# EAGLE design main (EAGLE 6.5.0)
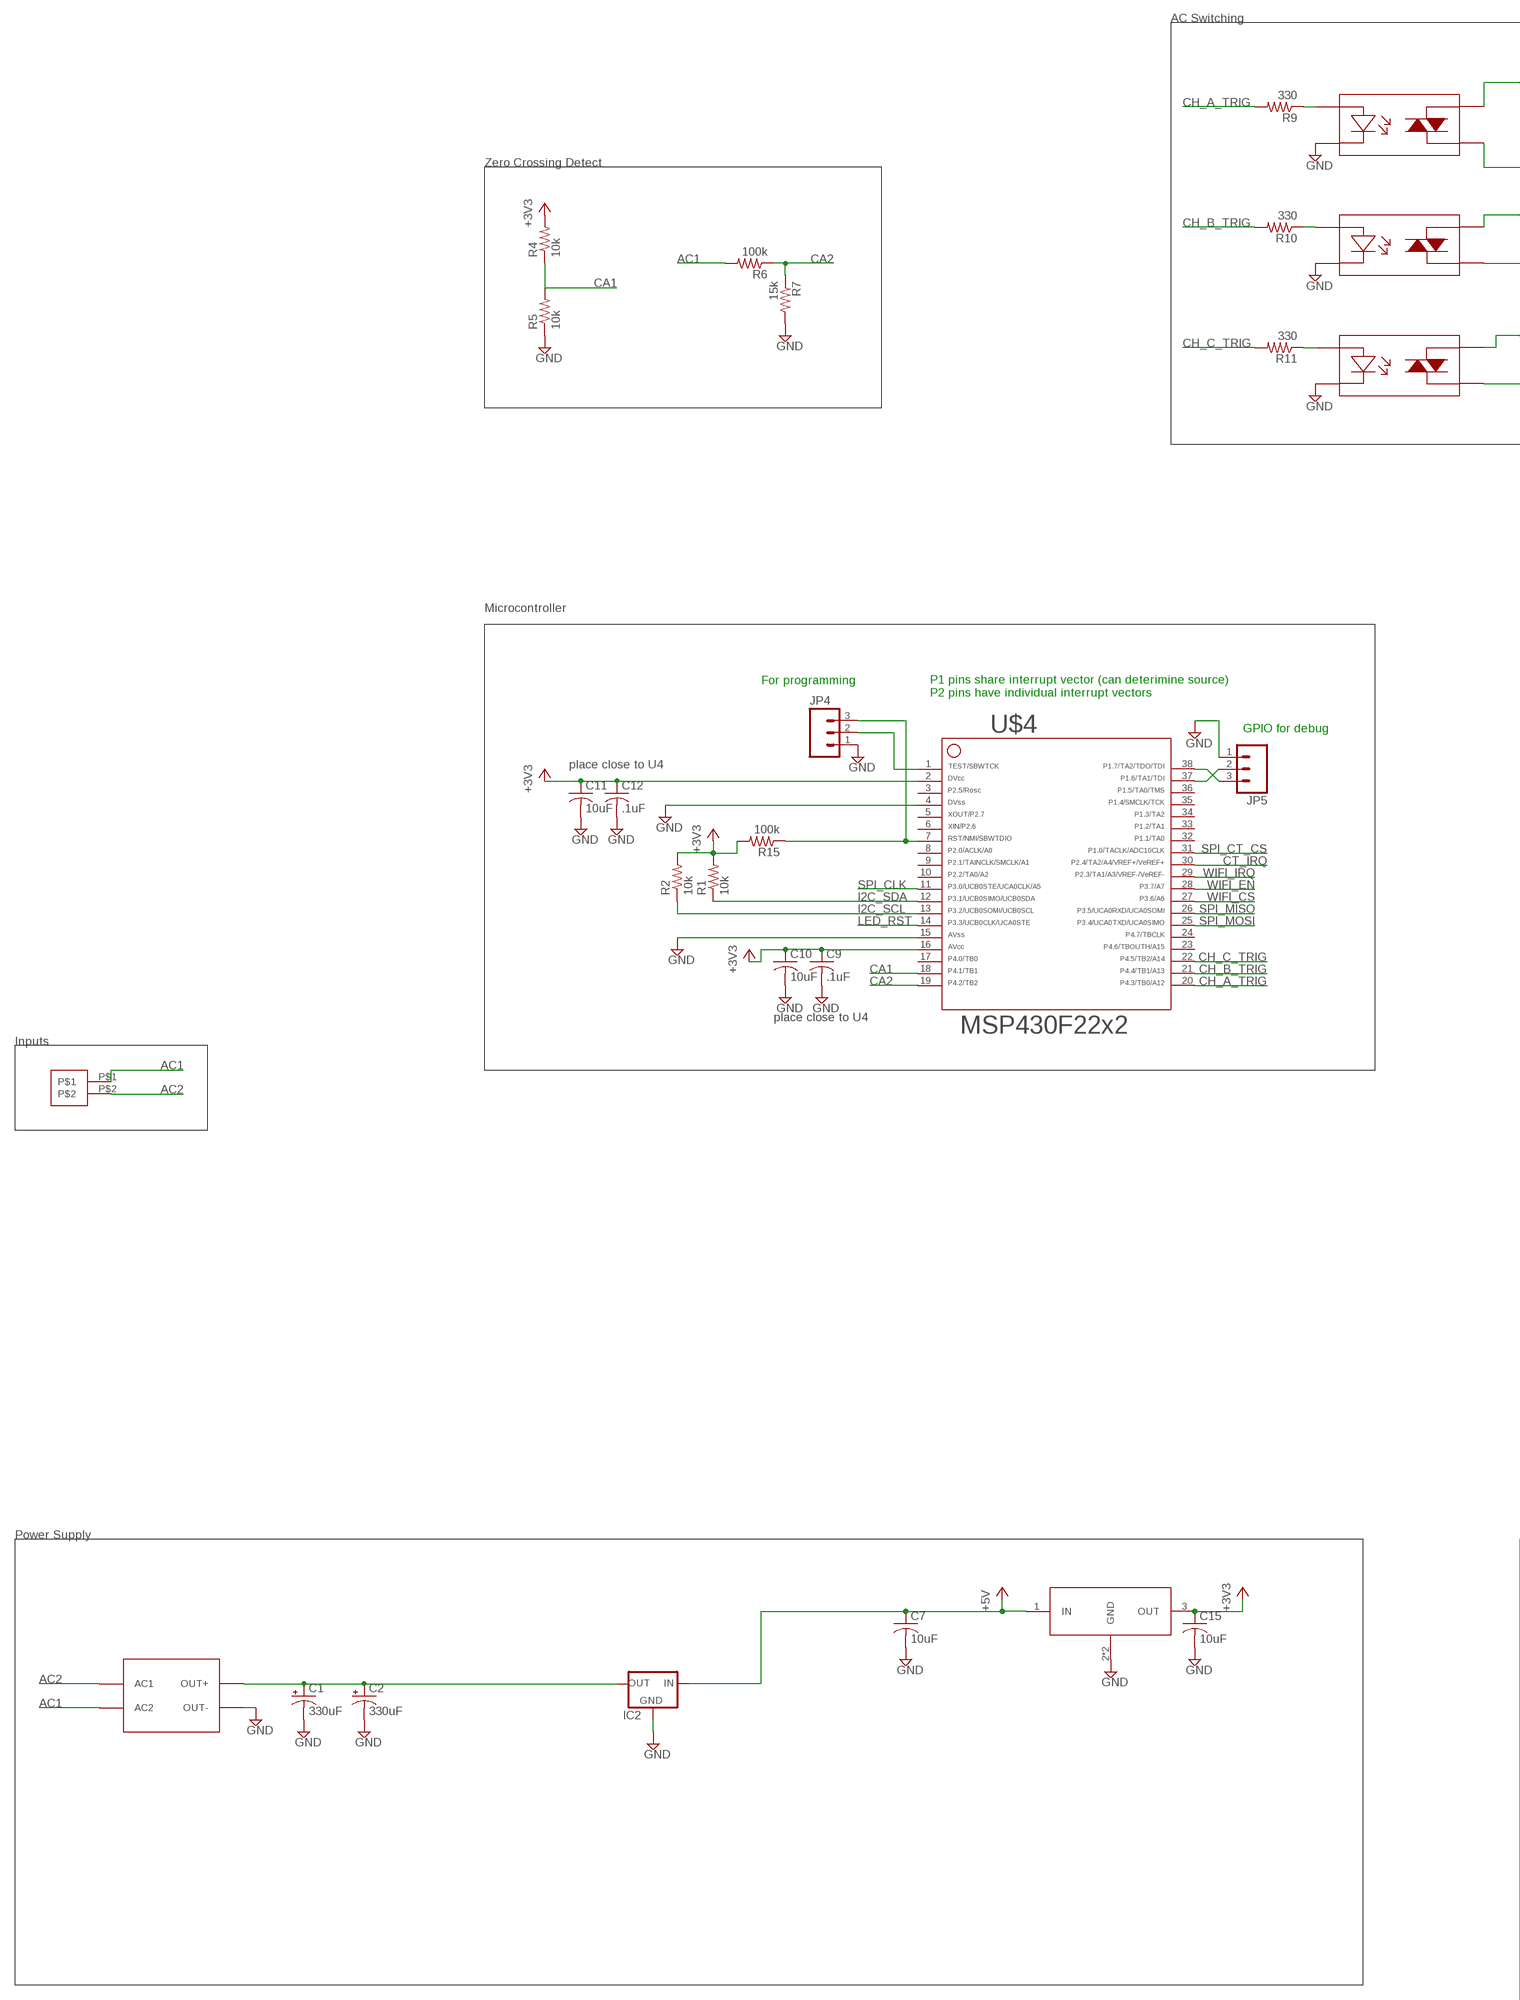
[diagram p0: schematic, sheet 1, part 1 of 2]
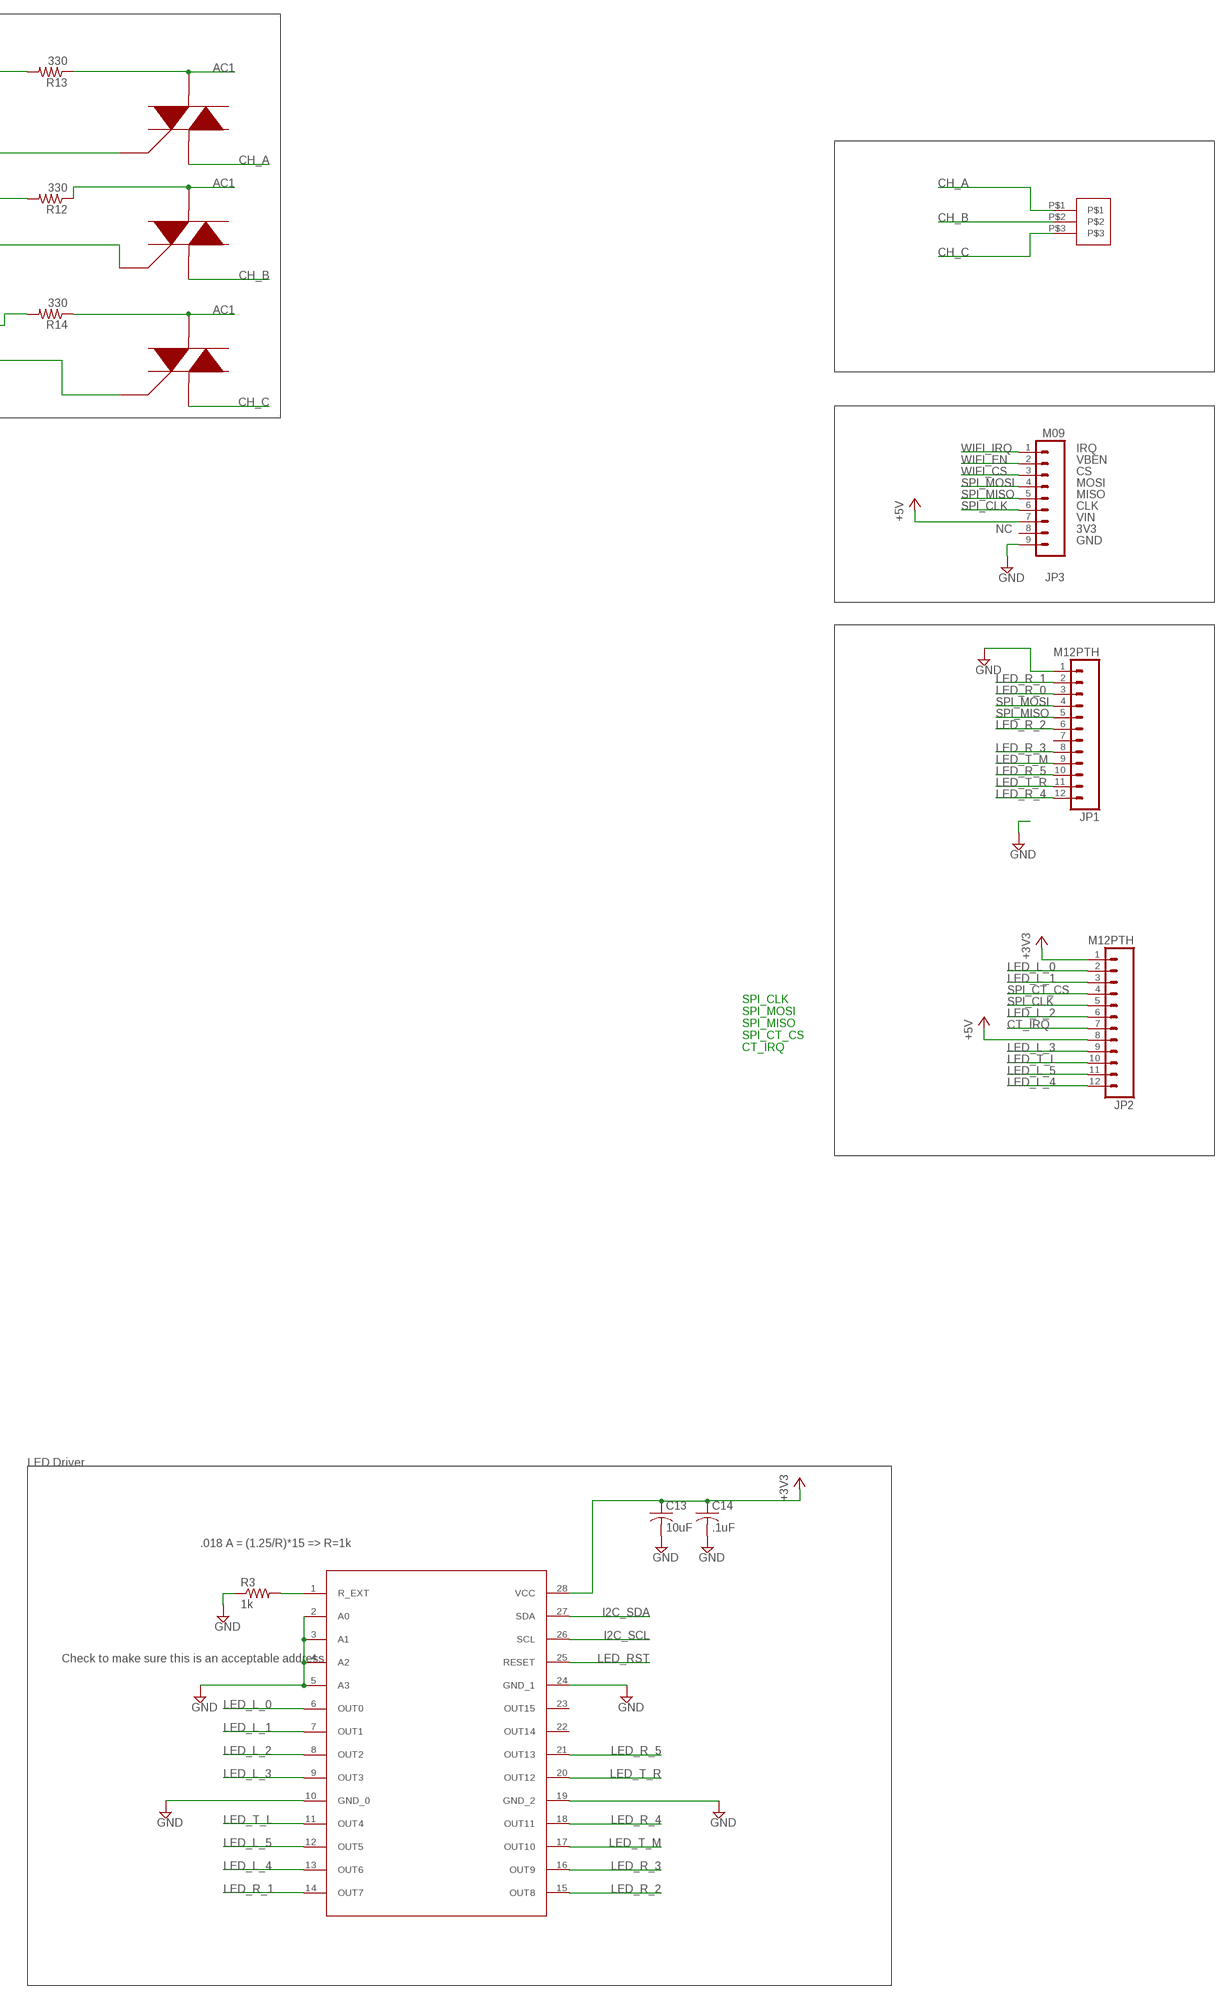
[diagram p1: schematic, sheet 1, part 2 of 2]

## Parts
C1  330uF  EEE-1VA331UAP  [RADIAL_CAN_SMD]
C2  330uF  EEE-1VA331UAP  [RADIAL_CAN_SMD]
C7  10uF  C-USC0603K  [C0603K]
C9  .1uF  C-USC0603K  [C0603K]
C10  10uF  C-USC0603K  [C0603K]
C11  10uF  C-USC0603K  [C0603K]
C12  .1uF  C-USC0603K  [C0603K]
C13  10uF  C-USC0603K  [C0603K]
C14  .1uF  C-USC0603K  [C0603K]
C15  10uF  C-USC0603K  [C0603K]
IC2  V_REG_78XX-TO-220  [TO-220-ALT]
J1  3-1437646-3  [3-1437646-3]
J2  3-1437646-9  [3-1437646-9]
JP1  M12PTH  [1X12]
JP2  M12PTH  [1X12]
JP3  M09  [1X09]
JP4  M03PTH  [1X03]
JP5  M03PTH  [1X03]
R1  10k  R-US_R0603  [R0603]
R2  10k  R-US_R0603  [R0603]
R3  1k  R-US_R0603  [R0603]
R4  10k  R-US_R0603  [R0603]
R5  10k  R-US_R0603  [R0603]
R6  100k  R-US_R0603  [R0603]
R7  15k  R-US_R0603  [R0603]
R9  330  R-US_R0603  [R0603]
R10  330  R-US_R0603  [R0603]
R11  330  R-US_R0603  [R0603]
R12  330  R-US_R0603  [R0603]
R13  330  R-US_R0603  [R0603]
R14  330  R-US_R0603  [R0603]
R15  100k  R-US_R0603  [R0603]
U$1  FODM3011  [SMD-4]
U$2  DS1501S-T  [DF-S]
U$3  TLC59116  [PW_28]
U$4  F22X2---DA38  [DA38]
U$5  LM2937  [SOT223]
U$6  FODM3011  [SMD-4]
U$7  FODM3011  [SMD-4]
U$9  BT-137S-600D  [SOT428]
U$10  BT-137S-600D  [SOT428]
U$11  BT-137S-600D  [SOT428]

## Nets
+3V3: C9.1 C10.1 C11.1 C12.1 C13.1 C14.1 C15.1 JP2.1 R1.2 R2.2 R4.2 R15.2 U$3.28(VCC) U$4.2 U$4.16 U$5.3(OUT)
+5V: C7.1 IC2.IN JP2.8 JP3.7 U$5.1(IN)
AC1: J1.P$1 R6.2 R12.1 R13.1 R14.1 U$2.P$4(AC2) U$9.T2(S2) U$10.T2(S2) U$11.T2(S2)
AC2: J1.P$2 U$2.P$3(AC1)
CA1: R4.1 R5.2 U$4.18
CA2: R6.1 R7.1 U$4.19
CH_A: J2.P$1 U$9.T1(S1)
CH_A_TRIG: R9.2 U$4.20
CH_B: J2.P$2 U$10.T1(S1)
CH_B_TRIG: R10.2 U$4.21
CH_C: J2.P$3 U$11.T1(S1)
CH_C_TRIG: R11.2 U$4.22
CT_IRQ: JP2.7 U$4.30
GND: C1.- C2.- C7.2 C9.2 C10.2 C11.2 C12.2 C13.2 C14.2 C15.2 IC2.GND JP1.1 JP3.9 JP4.1 JP5.1 R3.1 R5.1 R7.2 U$1.P$2(LED-) U$2.P$2(OUT-) U$3.2(A0) U$3.3(A1) U$3.4(A2) U$3.5(A3) U$3.10(GND_0) U$3.19(GND_2) U$3.24(GND_1) U$4.4 U$4.15 U$5.2(GND) U$5.4(GND) U$6.P$2(LED-) U$7.P$2(LED-)
I2C_SCL: R2.1 U$3.26(SCL) U$4.13
I2C_SDA: R1.1 U$3.27(SDA) U$4.12
LED_L_0: JP2.2 U$3.6(OUT0)
LED_L_1: JP2.3 U$3.7(OUT1)
LED_L_2: JP2.6 U$3.8(OUT2)
LED_L_3: JP2.9 U$3.9(OUT3)
LED_L_4: JP2.12 U$3.13(OUT6)
LED_L_5: JP2.11 U$3.12(OUT5)
LED_R_0: JP1.3
LED_R_1: JP1.2 U$3.14(OUT7)
LED_R_2: JP1.6 U$3.15(OUT8)
LED_R_3: JP1.8 U$3.16(OUT9)
LED_R_4: JP1.12 U$3.18(OUT11)
LED_R_5: JP1.10 U$3.21(OUT13)
LED_RST: U$3.25(RESET) U$4.14
LED_T_L: JP2.10 U$3.11(OUT4)
LED_T_M: JP1.9 U$3.17(OUT10)
LED_T_R: JP1.11 U$3.20(OUT12)
N$1: C1.+ C2.+ IC2.OUT U$2.P$1(OUT+)
N$2: JP4.3 R15.1 U$4.7
N$3: JP4.2 U$4.1
N$4: JP5.3 U$4.38
N$5: JP5.2 U$4.37
N$8: R3.2 U$3.1(R_EXT)
N$11: R9.1 U$1.P$1(LED+)
N$12: R10.1 U$6.P$1(LED+)
N$13: R11.1 U$7.P$1(LED+)
N$14: R14.2 U$7.P$3(S1)
N$15: U$7.P$4(S2) U$11.G
N$18: R12.2 U$6.P$3(S1)
N$19: U$6.P$4(S2) U$10.G
N$21: R13.2 U$1.P$3(S1)
N$22: U$1.P$4(S2) U$9.G
SPI_CLK: JP2.5 JP3.6 U$4.11
SPI_CT_CS: JP2.4 U$4.31
SPI_MISO: JP1.5 JP3.5 U$4.26
SPI_MOSI: JP1.4 JP3.4 U$4.25
WIFI_CS: JP3.3 U$4.27
WIFI_EN: JP3.2 U$4.28
WIFI_IRQ: JP3.1 U$4.29
Unconnected: JP1.7 JP3.8 U$3.22(OUT14) U$3.23(OUT15) U$4.3 U$4.5 U$4.6 U$4.8 U$4.9 U$4.10 U$4.17 U$4.23 U$4.24 U$4.32 U$4.33 U$4.34 U$4.35 U$4.36

## Notes on the sheet
- AC Switching
- Zero Crossing Detect
- IRQ
- VBEN
- CS
- MOSI
- MISO
- CLK
- VIN
- NC | 3V3
- GND
- Microcontroller
- For programming
- P1 pins share interrupt vector (can deterimine source)
  P2 pins have individual interrupt vectors
- GPIO for debug
- place close to U4
- place close to U4
- Inputs
- SPI_CLK
  SPI_MOSI
  SPI_MISO
  SPI_CT_CS
  CT_IRQ
- Power Supply | LED Driver
- .018 A = (1.25/R)*15 => R=1k
- Check to make sure this is an acceptable address

## Library data of the parts
C1 C2 = smart_switch:EEE-1VA331UAP
C7 C9-C15 = resistor:C-US: CAPACITOR, American symbol
IC2 = SparkFun-PowerIC:V_REG_78XX: Voltage Regulator Standard 7805 5V regulator. IGO (Input Ground Output). Spark Fun Electronics SKU : COM-00107
J1 = smart_switch:3-1437646-3
J2 = smart_switch:3-1437646-9
JP1 JP2 = SparkFun-Connectors:M12: Header 12 Standard 12-pin 0.1" header. Use with straight break away headers (SKU : PRT-00116), right angle break away headers (PRT-00553), swiss pins (PRT-00743), machine pins (PRT-00117), and female headers (PRT-00115).
JP3 = SparkFun-Connectors:M09: Header 9 Standard 9-pin 0.1" header. Use with straight break away headers (SKU : PRT-00116), right angle break away headers (PRT-00553), swiss pins (PRT-00743), machine pins (PRT-00117), and female headers (PRT-00115).
JP4 JP5 = SparkFun-Connectors:M03: Header 3 Standard 3-pin 0.1" header. Use with straight break away headers (SKU : PRT-00116), right angle break away headers (PRT-00553), swiss pins (PRT-00743), machine pins (PRT-00117), and female headers (PRT-00115). Molex polarized connector foot print use with SKU : PRT-08232 with associated crimp pins and housings.
R1-R7 R9-R15 = resistor:R-US_: RESISTOR, American symbol
U$1 U$6 U$7 = smart_switch:FODM3011
U$2 = smart_switch:DS1501S-T
U$3 = smart_switch:TLC59116
U$4 = TI_MSP430_v16:F22X2---DA38: ***MSP430F22x2***DA38
U$5 = smart_switch:LM2937
U$9-U$11 = smart_switch:BT-137S-600D

## Board
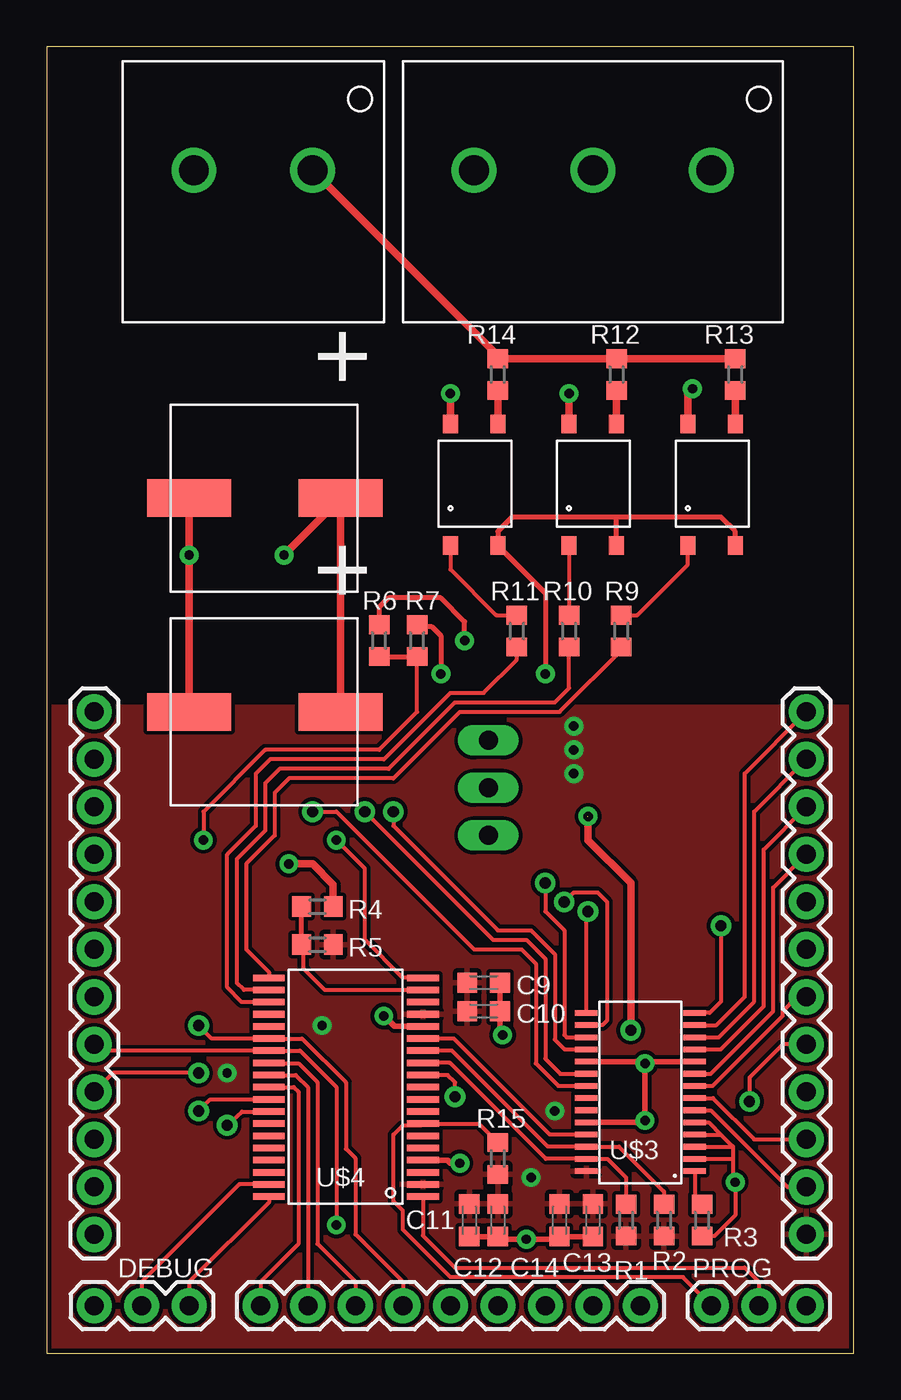
[diagram p2: board, top side]
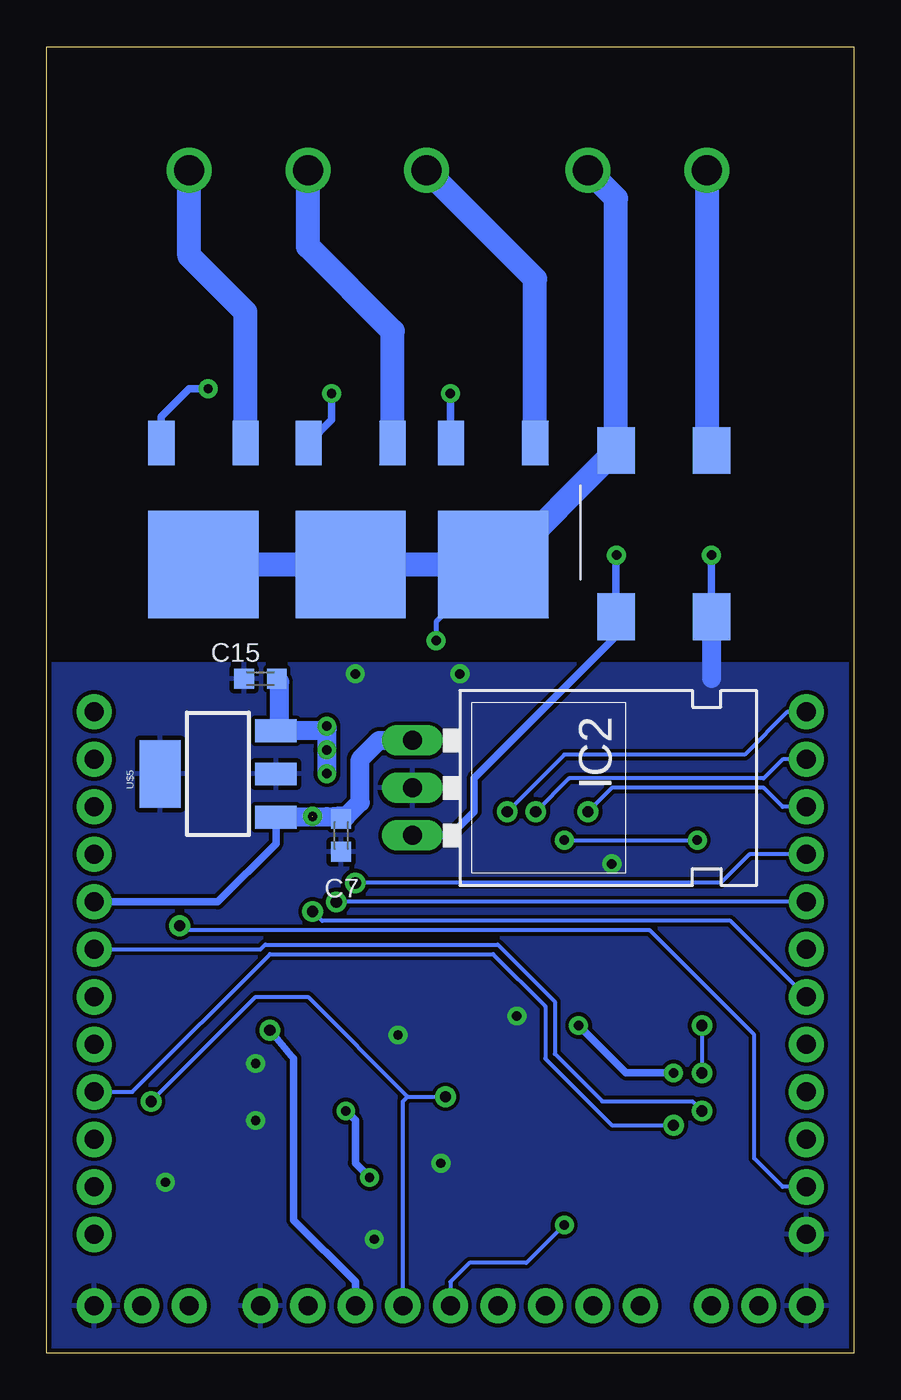
[diagram p3: board, bottom side, seen from below]

Size 43.18 x 69.85 mm. Coordinates in mm from the lower left corner, seen from the top.
Outline: 0,0 43.18,0 43.18,69.85 0,69.84 0,0
Copper layers (1*16): Top 0.035mm / dielectric 1.5mm / Bottom 0.035mm
Design rules "SparkFun": minimum track width 8mil, minimum drill 20mil, track to track 8mil, track to pad 8mil, pad to pad 8mil, via to via 8mil, smd to smd 8mil, copper to edge 10mil, drill to drill 8mil, minimum pad ring 12mil, minimum via ring 10mil, stop-mask expansion 4mil, vias tented up to drill 25mil, thermal gap 10mil

### Footprints (pad centres in the part's own frame; a part is rotated, then mirrored left to right if it is on the bottom)
RADIAL_CAN_SMD = smd 2 x 4.5: + 0,-8.1; - 0,0
C0603K = smd 1.05 x 1.08: 1 -0.875,0; 2 0.875,0
TO-220-ALT = drill 1.016 long: GND 0,-3.81; IN -2.54,-3.81; OUT 2.54,-3.81
3-1437646-3 = drill 1.6: P$1 0,0; P$2 6.35,0
3-1437646-9 = drill 1.6: P$1 -6.35,0; P$2 0,0; P$3 6.35,0
1X12 = drill 1.016 pad 1.88: 1 0,0; 2 2.54,0; 3 5.08,0; 4 7.62,0; 5 10.16,0; 6 12.7,0; 7 15.24,0; 8 17.78,0; 9 20.32,0; 10 22.86,0; 11 25.4,0; 12 27.94,0
1X09 = drill 1.016 pad 1.88: 1 0,0; 2 2.54,0; 3 5.08,0; 4 7.62,0; 5 10.16,0; 6 12.7,0; 7 15.24,0; 8 17.78,0; 9 20.32,0
1X03 = drill 1.016 pad 1.88: 1 0,0; 2 2.54,0; 3 5.08,0
R0603 = smd 1 x 1.1: 1 -0.85,0; 2 0.85,0
SMD-4 = smd 0.8 x 1: P$1 0,0; P$2 2.54,0; P$3 2.54,6.5; P$4 0,6.5
DF-S = smd 2 x 2.5: P$1 5.1,0; P$2 0,0; P$3 0,-8.9; P$4 5.1,-8.9
PW_28 = smd 0.3 x 1.2: 1 -4.229,-2.908; 2 -3.579,-2.908; 3 -2.929,-2.908; 4 -2.279,-2.908; 5 -1.629,-2.908; 6 -0.979,-2.908; 7 -0.329,-2.908; 8 0.321,-2.908; 9 0.971,-2.908; 10 1.621,-2.908; 11 2.271,-2.908; 12 2.921,-2.908; 13 3.571,-2.908; 14 4.221,-2.908; 15 4.221,2.892; 16 3.571,2.892; 17 2.921,2.892; 18 2.271,2.892; 19 1.621,2.892; 20 0.971,2.892; 21 0.321,2.892; 22 -0.329,2.892; 23 -0.979,2.892; 24 -1.629,2.892; 25 -2.279,2.892; 26 -2.929,2.892; 27 -3.579,2.892; 28 -4.229,2.892
DA38 = smd 0.35 x 1.705: 1 -5.85,-4.12; 2 -5.2,-4.12; 3 -4.55,-4.12; 4 -3.9,-4.12; 5 -3.25,-4.12; 6 -2.6,-4.12; 7 -1.95,-4.12; 8 -1.3,-4.12; 9 -0.65,-4.12; 10 0,-4.12; 11 0.65,-4.12; 12 1.3,-4.12; 13 1.95,-4.12; 14 2.6,-4.12; 15 3.25,-4.12; 16 3.9,-4.12; 17 4.55,-4.12; 18 5.2,-4.12; 19 5.85,-4.12; 20 5.85,4.12; 21 5.2,4.12; 22 4.55,4.12; 23 3.9,4.12; 24 3.25,4.12; 25 2.6,4.12; 26 1.95,4.12; 27 1.3,4.12; 28 0.65,4.12; 29 0,4.12; 30 -0.65,4.12; 31 -1.3,4.12; 32 -1.95,4.12; 33 -2.6,4.12; 34 -3.25,4.12; 35 -3.9,4.12; 36 -4.55,4.12; 37 -5.2,4.12; 38 -5.85,4.12
SOT223 = smd 1.219 x 2.235: 1 -2.311,-3.099; 2 0,-3.099; 3 2.311,-3.099 | smd 3.6 x 2.2: 4 0,3.099
SOT428 = smd 1.4 x 2.4: G 2.25,-6.5; T1 -2.25,-6.5 | smd 5.9 x 5.75: T2 0,0

### Placement (x,y rotation side)
C1  7.62,34.29 90 top
C2  7.62,45.72 90 top
C7  27.43,27.69 270 bottom
C9  23.37,19.81 0 top
C10  23.37,18.29 0 top
C11  22.61,7.11 270 top
C12  24.13,7.11 270 top
C13  29.21,7.11 270 top
C14  27.43,7.11 270 top
C15  31.75,36.07 180 bottom
IC2  19.81,30.23 270 bottom
J1  14.22,63.25 180 top
J2  29.21,63.25 180 top
JP1  2.54,6.35 90 top
JP2  40.64,6.35 90 top
JP3  11.43,2.54 0 top
JP4  40.64,2.54 180 top
JP5  2.54,2.54 0 top
R1  30.99,7.11 270 top
R2  33.02,7.11 270 top
R3  35.05,7.11 90 top
R4  14.48,21.84 0 top
R5  14.48,23.88 180 top
R6  17.78,38.1 90 top
R7  19.81,38.1 90 top
R9  30.73,38.61 270 top
R10  27.94,38.61 270 top
R11  25.15,38.61 270 top
R12  30.48,52.32 270 top
R13  36.83,52.32 270 top
R14  24.13,52.32 270 top
R15  24.13,10.41 270 top
U$1  34.29,43.18 0 top
U$2  7.62,39.37 180 bottom
U$3  31.75,13.97 90 top
U$4  16,14.22 90 top
U$5  34.02,30.97 90 bottom
U$6  27.94,43.18 0 top
U$7  21.59,43.18 0 top
U$9  34.8,42.16 180 bottom
U$10  26.92,42.16 180 bottom
U$11  19.3,42.16 180 bottom

### Tracks (layer width: path | path; a pad name or v marks a point on that pad's centre or on a via)
+3V3  (via drill 0.5)
  Bottom 0.254: 30.72,33.49 U$5.3
  Bottom 0.406: v14.73,17.53 12.19,14.99 v9.65,14.99 | v27.18,12.95 26.67,12.45 26.67,10.16 v25.91,9.4
  Bottom 1.016: v28.19,30.99 v28.19,32.26 v28.19,33.53 28.18,33.28 U$5.3 | 30.72,33.49 30.72,35.89 C15.1
  pour Top: 0,0 43.18,0 43.18,34.54 0,34.54
+5V  (via drill 0.5, 0.6)  (1 unrouted)
  Top 0.406: v31.24,17.27 31.24,25.15 28.96,27.43 28.96,28.69
  Bottom 0.254: 27.66,28.66 C7.1 | 30.9,28.69 U$5.1
  Bottom 0.406: v31.24,17.27 29.97,15.75 29.97,7.11 26.67,3.81 JP3.7 | U$5.1 30.92,27.24 34.04,24.13 JP2.8 | v28.96,28.7 28.94,28.69 28.19,28.69
  Bottom 1.016: 30.9,28.69 28.19,28.69 27.84,28.69 C7.1 27.67,28.7 27.16,28.7 26.42,29.45 26.42,31.75 25.4,32.77 IC2.IN
AC1  (via drill 0.5)
  Top 0.254: v22.35,38.1 22.35,39.12 21.08,40.39 18.29,40.39 17.78,39.88 R6.2
  Top 0.406: R13.1 R12.1 R14.1 24.13,53.34 J1.P$1
  Bottom 0.254: U$11.T2 22.35,39.12 v22.35,38.1
  Bottom 1.27: J1.P$1 12.72,61.74 U$2.P$4 18.83,42.16 U$11.T2 U$10.T2 U$9.T2
AC2
  Bottom 1.27: J1.P$2 7.87,48.52 U$2.P$3
CA1
  Top 0.203: R4.1 13.72,21.25 13.72,20.57 14.87,19.42 U$4.18
  Top 0.254: R4.1 R5.2
CA2  (via drill 0.5)
  Top 0.203: R6.1 17.53,37.08 | R7.1 19.81,34.29 17.78,32.26 11.68,32.26 8.38,28.96 v8.38,27.43 | U$4.19 19.04,20.07 17.02,22.1 17.02,25.91 v15.49,27.43
  Top 0.254: R6.1 R7.1
  Bottom 0.203: v15.49,27.43 v8.38,27.43
CH_A
  Bottom 1.27: U$9.T1 32.55,55.66 35.56,58.67 J2.P$1
CH_A_TRIG
  Top 0.203: R9.2 30.9,37.76 27.43,34.29 22.1,34.29 18.54,30.73 12.95,30.73 12.19,29.97 12.19,27.69 10.67,26.16 10.67,21.59 11.88,20.38 U$4.20
CH_B
  Bottom 1.27: U$10.T1 24.67,54.65 29.21,59.18 J2.P$2
CH_B_TRIG
  Top 0.203: U$4.21 10.55,19.42 10.16,19.81 10.16,26.42 11.68,27.94 11.68,30.48 12.45,31.24 18.29,31.24 21.84,34.8 27.18,34.8 27.94,35.56 R10.2
CH_C
  Bottom 1.27: U$11.T1 17.05,57.44 J2.P$3
CH_C_TRIG
  Top 0.203: U$4.22 10.44,18.77 9.65,19.56 9.65,26.67 11.18,28.19 11.18,30.99 11.94,31.75 18.03,31.75 21.59,35.31 23.37,35.31 25.15,37.08 R11.2
CT_IRQ  (via drill 0.6)
  Top 0.203: v8.13,12.95 8.75,13.57 U$4.30
  Bottom 0.203: JP2.7 31.75,21.59 31.5,21.84 19.05,21.84 16,18.8 16,16 13.46,13.46 8.64,13.46 v8.13,12.95
GND  (via drill 0.5)
  Top 0.203: U$3.5 35.41,12.34 36.06,11.69 | 36.06,11.69 36.7,11.05 | U$3.4 36.06,11.69 | U$3.3 36.7,11.04 36.7,11.05 | 36.7,11.05 36.7,10.41 | 36.7,10.41 36.7,9.27 v36.83,9.14 36.83,7.37 35.73,6.26 R3.1 | U$3.2 36.68,10.39 36.7,10.41
  Top 0.254: v26.67,36.32 26.67,40.64 U$7.P$2 24.13,43.94 24.89,44.7 30.48,44.7 | R7.2 19.9,38.86 20.57,38.86 21.08,38.35 v21.08,36.32 | U$6.P$2 30.48,44.7 | U$1.P$2 36.83,43.94 36.07,44.7 30.48,44.7
  Top 0.305: 29.88,15.59 U$3.19 31.91,15.59 v32,15.49 | v32,12.45 32,12.19 32.15,12.34 | v32,12.45 v32,15.49 | v32,15.49 32.1,15.59 U$3.10 | U$3.24 31.9,12.34 v32,12.45 | C11.2 C12.2 24.02,6.1 v25.65,6.1 27.29,6.1 C14.2 C13.2 | U$4.4 21.43,10.32 21.59,10.16 v22.1,10.16 | v18.03,18.03 18.59,17.47 U$4.15 | v24.38,17.02 24.24,17.16 C10.2 C9.2
  Top 0.406: C2.- v7.62,42.67 C1.- | v12.95,26.16 14.22,26.16 15.33,25.06 R5.1
  Bottom 0.406: U$2.P$2 v7.62,42.67
  Bottom 1.016: U$2.P$2 7.62,36.07
  pour Bottom: 0,0 43.18,0 43.18,36.83 0,36.83
I2C_SCL
  Top 0.203: U$4.13 21.67,16.17 26.8,11.04 U$3.26 30.61,11.04 33.02,8.64 R2.1
I2C_SDA
  Top 0.203: U$4.12 21.56,15.52 26.69,10.39 U$3.27 30,10.39 30.99,9.4 R1.1
LED_L_0
  Top 0.203: U$3.6 35.52,12.99 39.62,8.89 JP2.2
LED_L_1
  Top 0.203: U$3.7 35.63,13.64 37.85,11.43 JP2.3
LED_L_2
  Top 0.203: U$3.8 35.63,14.29 39.37,18.03 39.37,18.29 40.13,19.05 JP2.6
LED_L_3
  Top 0.203: U$3.9 35.52,14.94 38.86,18.29 38.86,24.89 JP2.9
LED_L_4
  Top 0.203: U$3.13 35.83,17.54 37.34,19.05 37.34,30.99 JP2.12
LED_L_5
  Top 0.203: U$3.12 35.94,16.89 37.85,18.8 37.85,28.96 JP2.11
LED_R_1  (via drill 0.6)
  Top 0.203: v36.07,22.86 36.07,18.8 35.46,18.19 U$3.14
  Bottom 0.203: JP1.2 3.81,8.89 5.33,10.41 5.33,17.02 10.92,22.61 35.81,22.61 v36.07,22.86
LED_R_2  (via drill 0.6)
  Top 0.203: U$3.15 28.86,23.52 v28.96,23.62
  Bottom 0.203: JP1.6 6.6,23.11 28.45,23.11 v28.96,23.62
LED_R_3  (via drill 0.6)
  Top 0.203: v27.69,24.13 28.19,24.64 29.46,24.64 29.97,24.13 29.97,17.78 29.73,17.54 U$3.16
  Bottom 0.203: JP1.8 v27.69,24.13
LED_R_4  (via drill 0.6)
  Top 0.203: v18.54,28.96 18.54,28.19 24.13,22.61 25.91,22.61 27.18,21.34 27.18,16.76 27.7,16.24 U$3.18
  Bottom 0.203: JP1.12 3.56,34.29 5.84,32 15.49,32 v18.54,28.96
LED_R_5  (via drill 0.6)
  Top 0.203: v14.22,28.96 15.49,28.96 22.86,21.59 25.4,21.59 26.16,20.83 26.16,15.49 27.36,14.29 U$3.21
  Bottom 0.203: JP1.10 3.81,29.21 4.83,30.23 12.95,30.23 v14.22,28.96
LED_RST
  Top 0.203: U$3.25 26.92,11.69 21.78,16.82 U$4.14
LED_T_L
  Top 0.203: U$3.11 36.05,16.24 38.35,18.54 38.35,26.92 JP2.10
LED_T_M  (via drill 0.6)
  Top 0.203: v26.67,25.15 26.67,23.62 27.69,22.61 27.69,17.02 27.81,16.89 U$3.17
  Bottom 0.203: JP1.9 5.59,26.67 7.11,25.15 v26.67,25.15
LED_T_R  (via drill 0.6)
  Top 0.203: v17.02,28.96 23.88,22.1 25.65,22.1 26.67,21.08 26.67,15.75 27.48,14.94 U$3.20
  Bottom 0.203: JP1.11 3.81,31.75 4.83,30.73 15.24,30.73 v17.02,28.96
N$1  (via drill 0.5)
  Top 0.406: v12.7,42.67 12.7,42.7 C2.+ C1.+
  Bottom 0.406: v12.7,42.67 12.72,42.65 U$2.P$1 12.7,39.35 12.7,38.35 20.32,30.73 20.32,28.96 21.59,27.69 IC2.OUT
N$2
  Top 0.203: R15.1 23.12,12.27 U$4.7 20.04,12.19 19.05,12.19 18.54,11.68 18.54,8.13 19.05,7.62 19.05,6.6 21.59,4.06 34.04,4.06 JP4.3
N$3
  Top 0.203: U$4.1 20.12,6.29 21.84,4.57 37.34,4.57 38.1,3.81 JP4.2
N$4
  Top 0.203: U$4.38 11.88,8.07 7.62,3.81 JP5.3
N$5
  Top 0.203: U$4.37 10.29,9.02 5.08,3.81 JP5.2
N$8
  Top 0.203: U$3.1 34.66,7.9 R3.2
N$11
  Top 0.203: R9.1 31.58,39.46 34.29,42.16 U$1.P$1
N$12
  Top 0.203: U$6.P$1 R10.1
N$13
  Top 0.203: U$7.P$1 21.59,41.91 24.04,39.46 R11.1
N$14
  Top 0.406: R14.2 U$7.P$3
N$15  (via drill 0.5)
  Top 0.406: U$7.P$4 v21.59,51.31
  Bottom 0.406: v21.59,51.31 21.59,48.7 U$11.G
N$18
  Top 0.406: R12.2 U$6.P$3
N$19  (via drill 0.5)
  Top 0.406: U$6.P$4 v27.94,51.31
  Bottom 0.406: v27.94,51.31 27.94,49.9 U$10.G
N$21
  Top 0.406: R13.2 U$1.P$3
N$22  (via drill 0.5)
  Top 0.406: U$1.P$4 34.29,51.31 v34.54,51.56
  Bottom 0.406: v34.54,51.56 35.56,51.56 37.05,50.07 U$9.G
SPI_CLK  (via drill 0.6)
  Top 0.203: JP2.5 39.37,16.51 37.59,14.73 v37.59,13.46 | v21.84,13.72 21.84,14.48 21.45,14.87 U$4.11
  Bottom 0.203: v37.59,13.46 32,19.05 29.21,19.05 23.88,13.72 | 23.88,13.72 v21.84,13.72 | JP3.6 24.13,13.46 23.88,13.72
SPI_CT_CS  (via drill 0.6)
  Top 0.203: v9.65,12.19 10.44,12.92 U$4.31
  Bottom 0.203: JP2.4 38.61,13.97 31.24,21.34 19.3,21.34 16.51,18.54 16.51,15.75 12.95,12.19 v9.65,12.19
SPI_MISO  (via drill 0.5)
  Top 0.203: v15.49,6.86 15.49,14.22 13.54,16.17 U$4.26 2.88,16.17 JP1.5
  Bottom 0.203: JP3.5 21.59,3.81 20.57,4.83 17.53,4.83 v15.49,6.86
SPI_MOSI  (via drill 0.6)
  Top 0.203: JP3.4 19.05,3.81 16.51,6.35 16.51,10.41 16,10.92 16,14.48 13.66,16.82 U$4.25 8.83,16.82 v8.13,17.53 | v8.13,14.99 3.56,14.99 JP1.4
  Bottom 0.203: v8.13,17.53 v8.13,14.99
WIFI_CS
  Top 0.203: U$4.27 11.91,15.49 13.46,15.49 14.48,14.48 14.48,5.84 16.51,3.81 JP3.3
WIFI_EN
  Top 0.203: U$4.28 13.32,14.87 13.97,14.22 JP3.2
WIFI_IRQ
  Top 0.203: U$4.29 13.21,14.22 13.46,13.97 13.46,5.84 11.43,3.81 JP3.1

### Text on the board
tPlace: DEBUG | PROG